# EAGLE design PCB1 (EAGLE 9.5.2)
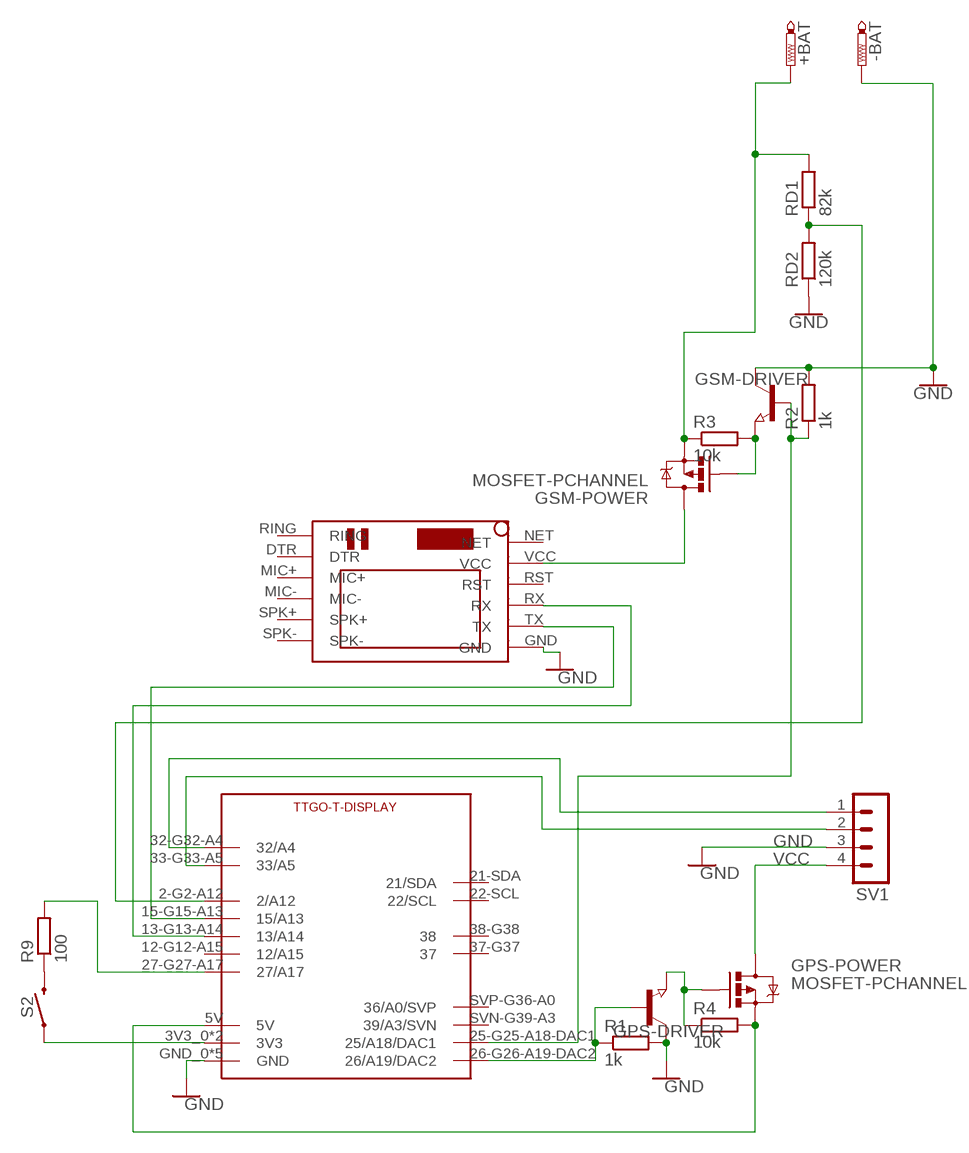
[diagram p0: schematic, sheet 1]

## Parts
+BAT  PTR1PAD1-13Y  [P1-13Y]
-BAT  PTR1PAD1-13Y  [P1-13Y]
GPS-DRIVER  NPN-TRANSISTOR_SOT23  [SOT23]
GPS-POWER  MOSFET-PCHANNEL  [SOT23-3]
GSM-DRIVER  NPN-TRANSISTOR_SOT23  [SOT23]
GSM-POWER  MOSFET-PCHANNEL  [SOT23-3]
R1  1k  RR0402  [R0402]
R2  1k  RR0402  [R0402]
R3  10k  RR0603  [R0603]
R4  10k  RR0603  [R0603]
R9  100  RR0603  [R0603]
RD1  82k  RR0402  [R0402]
RD2  120k  RR0402  [R0402]
S2  MOMENTARY-SWITCH-SPST-SMD-6.0X3.5MM  [TACTILE_SWITCH_SMD_6.0X3.5MM]
SV1  MA04-1  [MA04-1]
U$1  SIM800LMODULE  [SIM800LMODULE]
U$2  TTGO-T-DISPLAYFRAME  [TTGO-T-DISPLAY-OL]

## Nets
4/GSM_EN: GSM-DRIVER.1(B) R2.1 U$2.25-G25-A18-DAC1(25/A18/DAC1)
5/SCL: GPS-DRIVER.1(B) R1.1 U$2.26-G26-A19-DAC2(26/A19/DAC2)
5V: GPS-POWER.2(S) R4.2 U$2.5V
17/TX2: U$1.RX U$2.13-G13-A14(13/A14)
18/TX1: SV1.2 U$2.33-G33-A5(33/A5)
A0: RD1.1 RD2.2 U$2.2-G2-A12(2/A12)
GND: -BAT.TP GPS-DRIVER.3(C) GSM-DRIVER.3(C) R1.2 R2.2 RD2.1 SV1.3 U$1.GND U$2.GND_0(GND) U$2.GND_1(GND) U$2.GND_2(GND) U$2.GND_3(GND) U$2.GND_4(GND)
N$1: R9.1 S2.2
N$2: GPS-DRIVER.2(E) GPS-POWER.1(G) R4.1
N$3: +BAT.TP GSM-POWER.2(S) R3.1 RD1.2
N$4: GSM-POWER.3(D) U$1.VCC
N$5: GSM-DRIVER.2(E) GSM-POWER.1(G) R3.2
N$6: SV1.1 U$2.32-G32-A4(32/A4)
N$7: U$1.TX U$2.15-G15-A13(15/A13)
N$8: S2.1 U$2.3V3_0(3V3) U$2.3V3_1(3V3)
N$9: R9.2 U$2.27-G27-A17(27/A17)
VCC: GPS-POWER.3(D) SV1.4
Unconnected: U$1.DTR U$1.MIC+ U$1.MIC- U$1.NET U$1.RING U$1.RST U$1.SPK+ U$1.SPK- U$2.12-G12-A15(12/A15) U$2.21-SDA(21/SDA) U$2.22-SCL(22/SCL) U$2.37-G37 U$2.38-G38 U$2.SVN-G39-A3(39/A3/SVN) U$2.SVP-G36-A0(36/A0/SVP)

## Library data of the parts
+BAT -BAT = testpad:PTR1: TEST PIN
GPS-DRIVER GSM-DRIVER = semicon-smd-ipc:NPN-TRANSISTOR_: NPN TRANSISTOR
GPS-POWER GSM-POWER = User-Submitted:MOSFET-PCHANNEL: Generic PMOSFET IRLML2244 - TRANS-11153 (SOT-23 -20V -4.3A) (1.Gate 2.Source 3.Drain) FQP27P06 - COM-10349 <http://www.sparkfun.com/products/10349> (TO-220 -60V -27A) (1.Gate 2.Source 3.Drain); PROD_ID: TRANS-08285
R1-R4 R9 RD1 RD2 = eagle-ltspice:R: RESISTOR, European symbol; SPICEMODEL: NONE; SPICEPREFIX: R
S2 = SparkFun-Switches:MOMENTARY-SWITCH-SPST: Momentary Switch (Pushbutton) - SPST Normally-open (NO) SPST momentary switches (buttons, pushbuttons). Variants PTH-12MM - 12mm square, through-hole Momentary Pushbutton Switch - 12mm Square <https://www.sparkfun.com/products/9190> (COM-09190) PTH-6.0MM, PTH-6.0MM-KIT - 6.0mm square, through-hole Mini Pushbutton Switch <https://www.sparkfun.com/products/97> (COM-00097) KIT package intended for soldering kit's - only one side of pads' copper is exposed. PTH-RIGHT-ANGLE-KIT - Right-angle, through-hole Right Angle Tactile Button <https://www.sparkfun.com/products/10791> - Used on SparkFun BigTime Watch Kit <https://www.sparkfun.com/products/11734> SMD-12MM - 12mm square, surface-mount Tactile Button - SMD (12mm) <https://www.sparkfun.com/products/12993> (COM-12993) Used on SparkFun PicoBoard <https://www.sparkfun.com/products/11888> SMD-4.5MM - 4.5mm Square Trackball Switch Used on SparkFun Blackberry Trackballer Breakout <https://www.sparkfun.com/products/13169> SMD-4.6MMX2.8MM - 4.60mm x 2.80mm, surface mount Used on SparkFun SAMD21 Mini Breakout <https://www.sparkfun.com/products/13664> SMD-5.2MM, SMD-5.2-REDUNDANT - 5.2mm square, surface-mount Mini Pushbutton Switch - SMD <https://www.sparkfun.com/products/8720> (COM-08720) Used on Arduino Pro Mini <https://www.sparkfun.com/products/11114> REDUNDANT package connects both switch circuits together SMD-6.0X3.5MM - 6.0 x 3.5mm, surface mount Momentary Reset Switch SMD <https://www.sparkfun.com/products/8229> (COM-08229) SMD-6.2MM-TALL - 6.2mm square, surface mount Tactile Button - SMD (6mm) <https://www.sparkfun.com/products/12992> Used on SparkFun Digital Sandbox <https://www.sparkfun.com/products/12651> SMD-RIGHT-ANGLE - Right-angle, surface mount Used on SparkFun Block for Intel® Edison - Arduino <https://www.sparkfun.com/products/13036>; PROD_ID: SWCH-14278; SF_SKU: COM-08229
SV1 = con-lstb:MA04-1: PIN HEADER; OC_FARNELL: unknown; OC_NEWARK: unknown
U$1 = SIM800LMODULE:SIM800LMODULE: SIM800L Module
U$2 = TTGO-TDisplay:TTGO-T-DISPLAY: TTGO-TDisplay https://github.com/Xinyuan-LilyGO/TTGO-T-Display

## Board
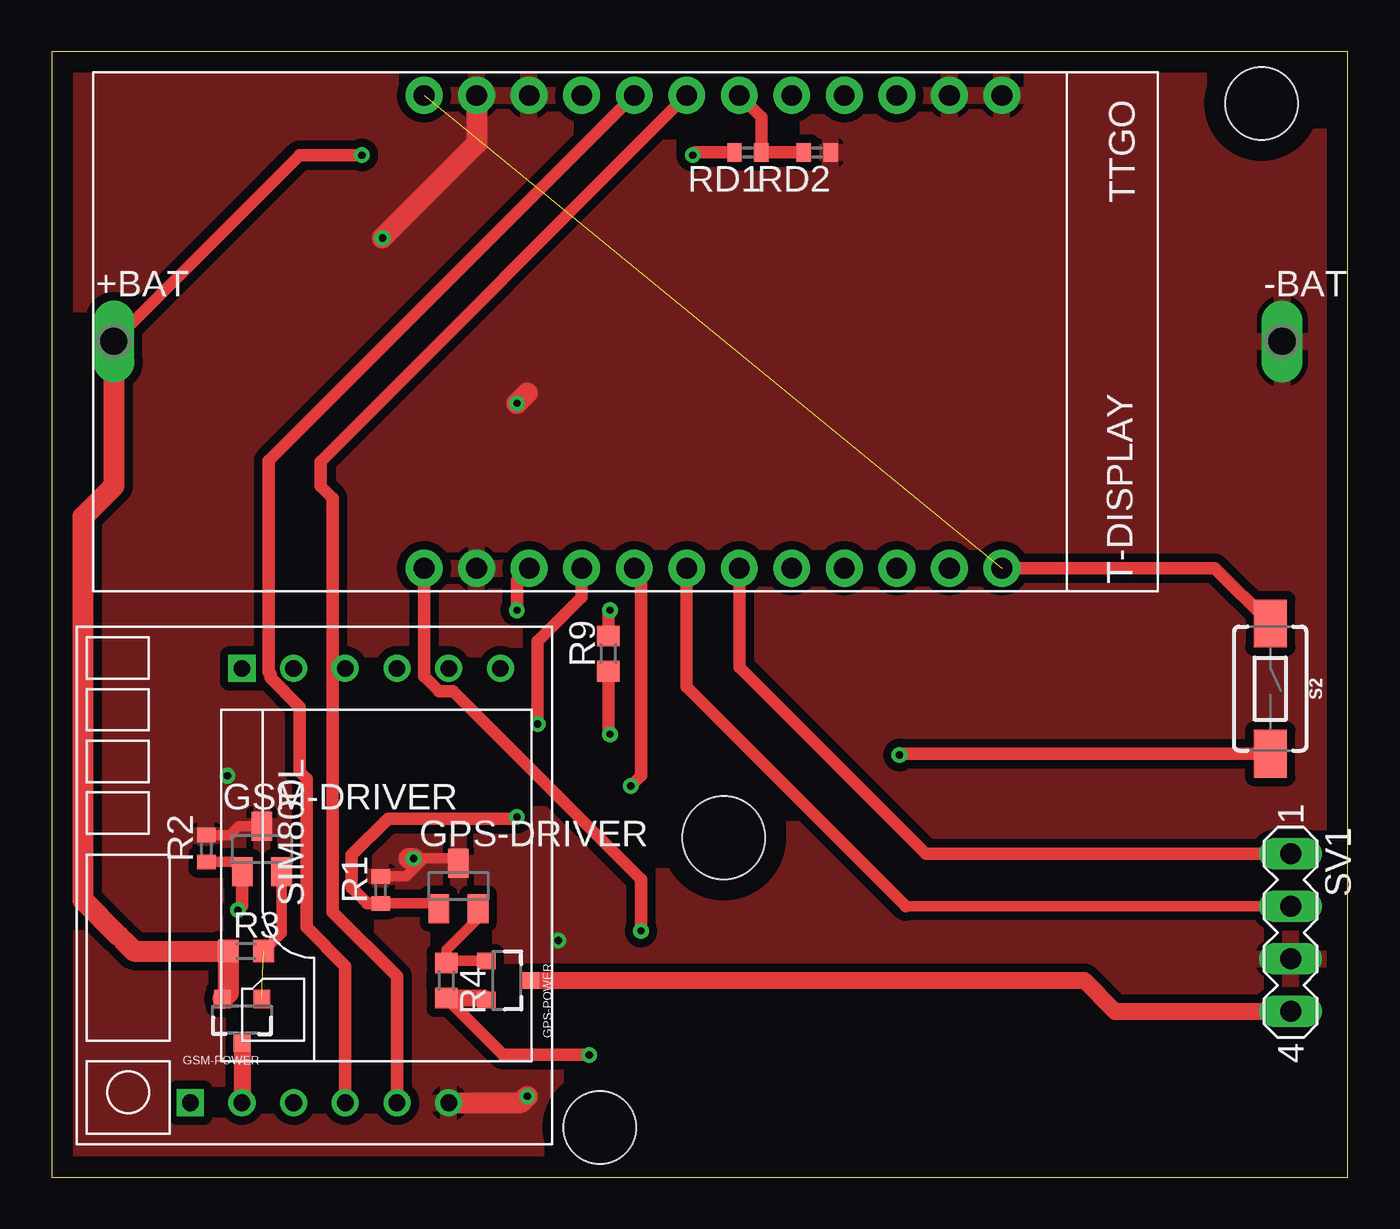
[diagram p1: board, top side]
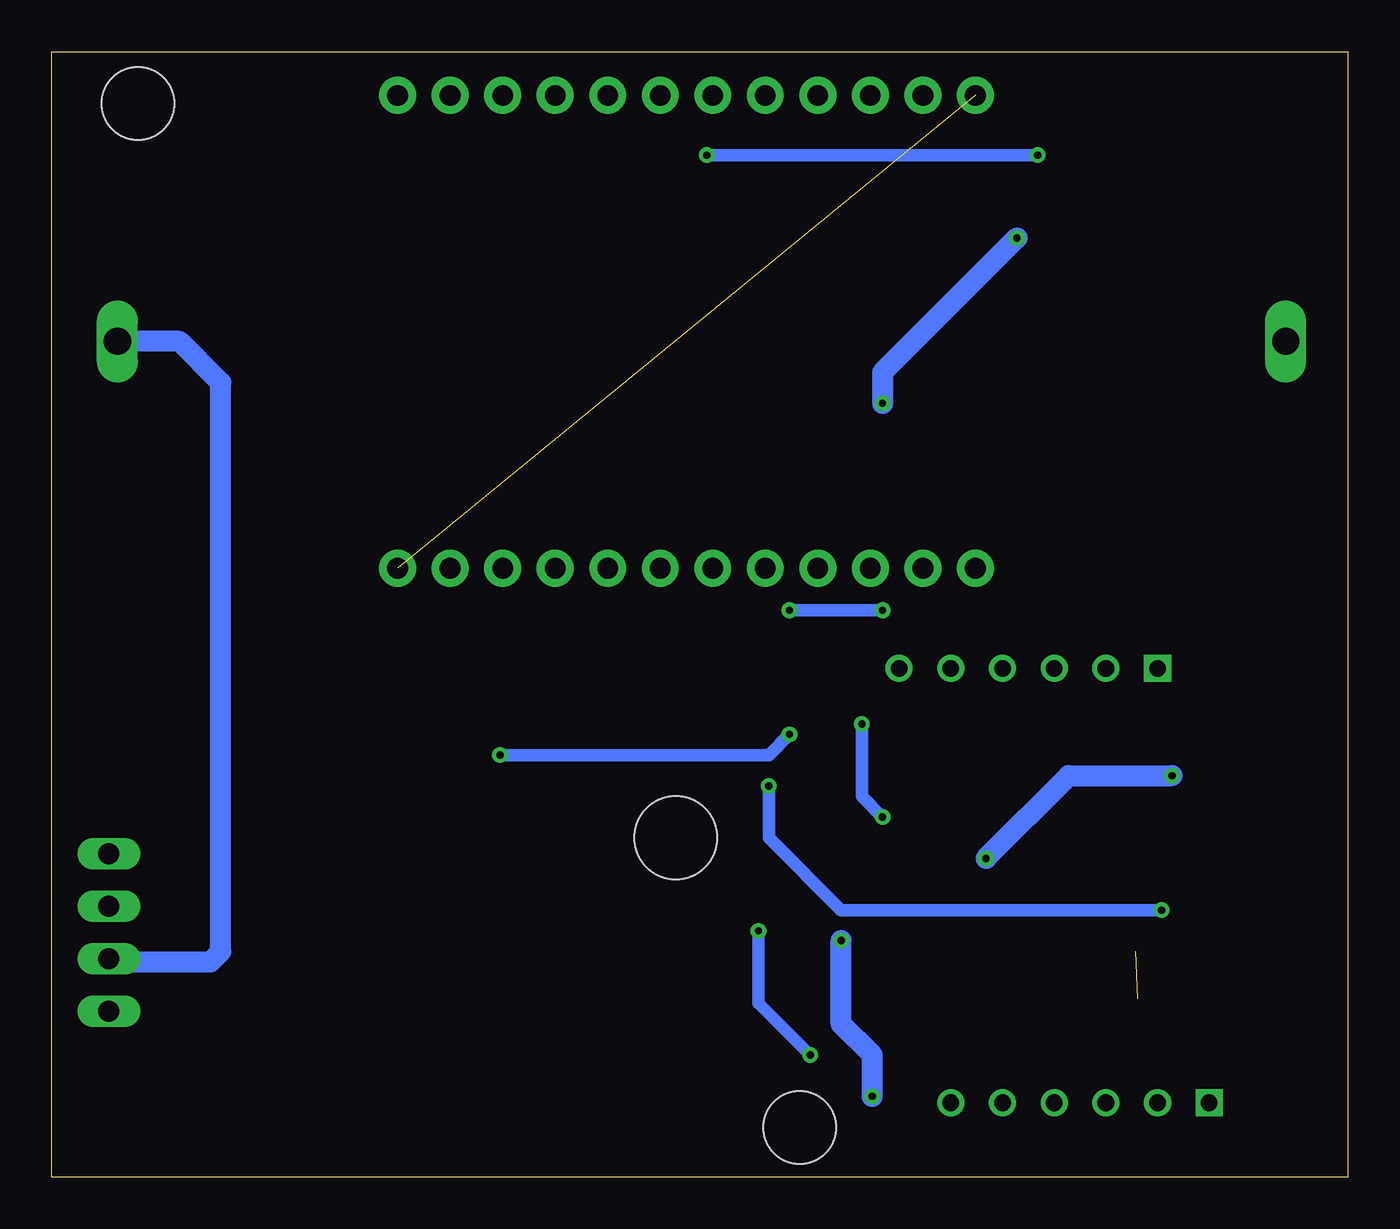
[diagram p2: board, bottom side, seen from below]

Size 62.68 x 54.4 mm. Coordinates in mm from the lower left corner, seen from the top.
Outline: 0,0 62.68,0 62.68,54.4 0,54.4 0,0
Copper layers (1*16): Top 0.035mm / dielectric 1.5mm / Bottom 0.035mm
Design rules "default": minimum track width 6mil, minimum drill 0.35mm, track to track 6mil, track to pad 6mil, pad to pad 6mil, via to via 6mil, smd to smd 6mil, copper to edge 40mil, drill to drill 6mil, minimum pad ring 10mil, minimum via ring 8mil, stop-mask expansion 4mil, vias tented up to drill 0mil, thermal gap 10mil
Holes 3.5 mm at 58.5,51.9 26.5,2.4
Holes 4 mm at 32.5,16.4

### Footprints (pad centres in the part's own frame; a part is rotated, then mirrored left to right if it is on the bottom)
P1-13Y = drill 1.321 pad 1.905 long: TP 0,0
SOT23 = smd 1 x 1.4: 1 -0.95,-1.1; 2 0.95,-1.1; 3 0,1.1
SOT23-3 = smd 0.8 x 0.9: 1 -0.95,-1; 2 0.95,-1; 3 0,1.1
R0402 = smd 0.7 x 0.9: 1 -0.65,0; 2 0.65,0
R0603 = smd 1 x 1.1: 1 -0.85,0; 2 0.85,0
TACTILE_SWITCH_SMD_6.0X3.5MM = smd 2.3 x 1.6: 1 -3.15,0; 2 3.15,0
MA04-1 = drill 1.016 long: 1 -3.81,0; 2 -1.27,0; 3 1.27,0; 4 3.81,0
SIM800LMODULE = drill 0.8: DTR 10.5,1; GND -10.5,-6.5; MIC+ 10.5,-1.5; MIC- 10.5,-4; RST -10.5,1; RX -10.5,-1.5; SPK+ 10.5,-6.5; SPK- 10.5,-9; TX -10.5,-4; VCC -10.5,3.5 | drill 0.8 square: NET -10.5,6; RING 10.5,3.5
TTGO-T-DISPLAY-OL = drill 1 pad 1.78: 2-G2-A12 1.11,31.25; 3V3_0 1.11,16.01; 3V3_1 23.97,43.95; 5V 23.97,16.01; 12-G12-A15 1.11,23.63; 13-G13-A14 1.11,26.17; 15-G15-A13 1.11,28.71; 17-NA 1.11,33.79; 21-SDA 1.11,38.87; 22-SCL 1.11,36.33; 25-G25-A18-DAC1 23.97,26.17; 26-G26-A19-DAC2 23.97,23.63; 27-G27-A17 23.97,21.09; 32-G32-A4 23.97,31.25; 33-G33-A5 23.97,28.71; 37-G37 23.97,38.87; 38-G38 23.97,36.33; GND_0 1.11,43.95; GND_1 1.11,41.41; GND_2 1.11,21.09; GND_3 1.11,18.55; GND_4 23.97,18.55; SVN-G39-A3 23.97,33.79; SVP-G36-A0 23.97,41.41

### Placement (x,y rotation side)
+BAT  3,40.4 0 top
-BAT  59.5,40.4 0 top
GPS-DRIVER  19.67,14.07 0 top
GPS-POWER  22.01,9.5 270 top
GSM-DRIVER  10.17,15.85 0 top
GSM-POWER  9.21,7.61 180 top
R1  15.91,13.88 90 top
R2  7.48,15.88 90 top
R3  9.4,10.92 0 top
R4  19.09,9.5 270 top
R9  26.92,25.3 90 top
RD1  33.67,49.53 180 top
RD2  37.02,49.53 180 top
S2  58.93,23.61 270 top
SV1  59.92,11.82 270 top
U$1  12.7,14.09 90 top
U$2  2,53.4 270 top

### Tracks (layer width: path | path; a pad name or v marks a point on that pad's centre or on a via)
4/GSM_EN  (via drill 0.35)
  Top 0.508: R2.1 8.74,15.23 GSM-DRIVER.1 9,14.53
  Top 0.61: v28,18.9 28.5,19.4 28.5,29.1 U$2.25-G25-A18-DAC1 | GSM-DRIVER.1 9.22,13.12 v9,12.9
  Bottom 0.61: v9,12.9 24.5,12.9 28,16.4 v28,18.9
5/SCL  (via drill 0.35)
  Top 0.508: R1.1 18.46,13.23 GPS-DRIVER.1
  Top 0.61: U$2.26-G26-A19-DAC2 25.63,28.03 23.5,25.9 v23.5,21.9 | v22.5,17.4 22.43,17.33 16.26,17.33 14.5,15.57 14.5,13.99 15.26,13.23 R1.1
  Bottom 0.61: v23.5,21.9 23.5,18.4 v22.5,17.4
5V  (via drill 0.35)
  Top 0.61: R4.2 21.84,5.9 v26,5.9 | v28.5,11.9 28.5,14.4 19.42,23.48 18.74,23.48 18.01,24.21 U$2.5V
  Top 0.813: R4.2 20.91,8.65 GPS-POWER.2
  Bottom 0.61: v28.5,11.9 28.5,8.4 v26,5.9
17/TX2
  Top 0.61: U$1.RX 14.2,10.2 12.34,12.06 12.34,19.25 12,19.58 12,22.72 10.59,24.13 10.59,24.31 10.5,24.4 10.5,34.62 U$2.13-G13-A14
18/TX1
  Top 0.508: SV1.2 41.31,13.09
  Top 0.61: U$2.33-G33-A5 30.71,23.69 41.31,13.09
A0
  Top 0.61: U$2.2-G2-A12 34.32,51.22 RD1.1 RD2.2
GND  (via drill 0.35)
  Top 0.508: R1.2 17.13,14.53 18,15.4 19.44,15.4 GPS-DRIVER.3 | R2.2 8.63,16.53 9.05,16.95 GSM-DRIVER.3
  Top 1.016: 17.28,15.4 v17.5,15.4 | U$1.GND 22.69,3.59 v23,3.9 | U$2.GND_3 20.55,49.95 v16,45.4 | 23,37.9 v22.5,37.4
  Bottom 1.016: v17.5,15.4 13.5,19.4 v8.5,19.4 | v23,3.9 23,5.9 24.5,7.4 v24.5,11.43 | v22.5,37.4 22.5,38.9 v16,45.4 | SV1.3 59.77,10.4 55,10.4 54.5,10.9 54.5,38.4 56.5,40.4 -BAT.TP
  pour Top (isolate 0.406): 0.5,53.9 62,53.9 62,0.4 0.5,0.4
N$1  (via drill 0.35)
  Top 0.61: S2.2 41.06,20.46 v41,20.4 | v27,21.4 26.92,21.48 R9.1
  Bottom 0.61: v41,20.4 28,20.4 v27,21.4
N$2
  Top 0.508: GPS-DRIVER.2 20.62,12.52 19.09,10.99 R4.1 19.19,10.45 GPS-POWER.1
N$3  (via drill 0.35)
  Top 0.61: +BAT.TP 12,49.4 v15,49.4 | v31,49.4 31.13,49.53 RD1.2
  Top 0.813: 8.28,8.62 GSM-POWER.2 | 3.5,11.4 3.25,11.65
  Top 1.016: +BAT.TP 3,33.4 1.52,31.92 1.52,13.38 3.25,11.65 | 3.5,11.4 3.98,10.92 R3.1 8.55,8.9 8.28,8.62
  Bottom 0.61: v15,49.4 v31,49.4
N$4
  Top 0.813: GSM-POWER.3 U$1.VCC
N$5  (1 unrouted)
  Top 0.508: GSM-DRIVER.2 11.12,11.79 R3.2
N$6
  Top 0.61: U$2.32-G32-A4 33.25,24.65 42.27,15.63 SV1.1
N$7
  Top 0.61: U$1.TX 16.7,9.7 13.59,12.81 13.59,32.81 13,33.4 13,34.58 U$2.15-G15-A13
N$8  (1 unrouted)
  Top 0.61: U$2.3V3_1 56.26,29.43 S2.1
N$9  (via drill 0.35)
  Top 0.61: R9.2 26.92,27.32 v27,27.4 | v22.5,27.4 22.5,28.84 U$2.27-G27-A17
  Bottom 0.61: v27,27.4 v22.5,27.4
VCC
  Top 0.813: GPS-POWER.3 49.93,9.5 51.42,8.01 SV1.4